# Altium schematic sheet band-stop_filter.SchDoc
size A4
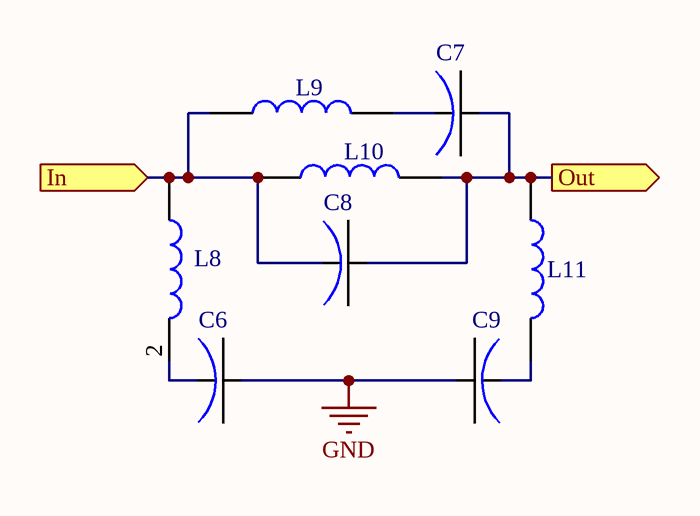
[diagram p0: band-stop_filter.SchDoc]

## Parts
C6  Cap  [C0805]  (value not drawn)
C7  Cap  [C0603]  (value not drawn)
C8  Cap  [C1206]  (value not drawn)
C9  Cap  [C0805]  (value not drawn)
L8  L1008  [L1008]  (value not drawn)
L9  L1812  [L1812]  (value not drawn)
L10  L1008  [L1008]  (value not drawn)
L11  L1008  [L1008]  (value not drawn)

## Ports
In (in), Out (out)

## Nets
GND: C6.2 C9.2
In: C8.1 L8.1 L9.1 L10.1 ; port In
Out: C7.2 C8.2 L10.2 L11.1 ; port Out
NetC6_1: C6.1 L8.2
NetC7_1: C7.1 L9.2
NetC9_1: C9.1 L11.2

## Library data of the parts
L8 L10 L11 = L1008: Vishay IMC1008E2RJ7
L9 = L1812: Vishay IMC1812ER150J